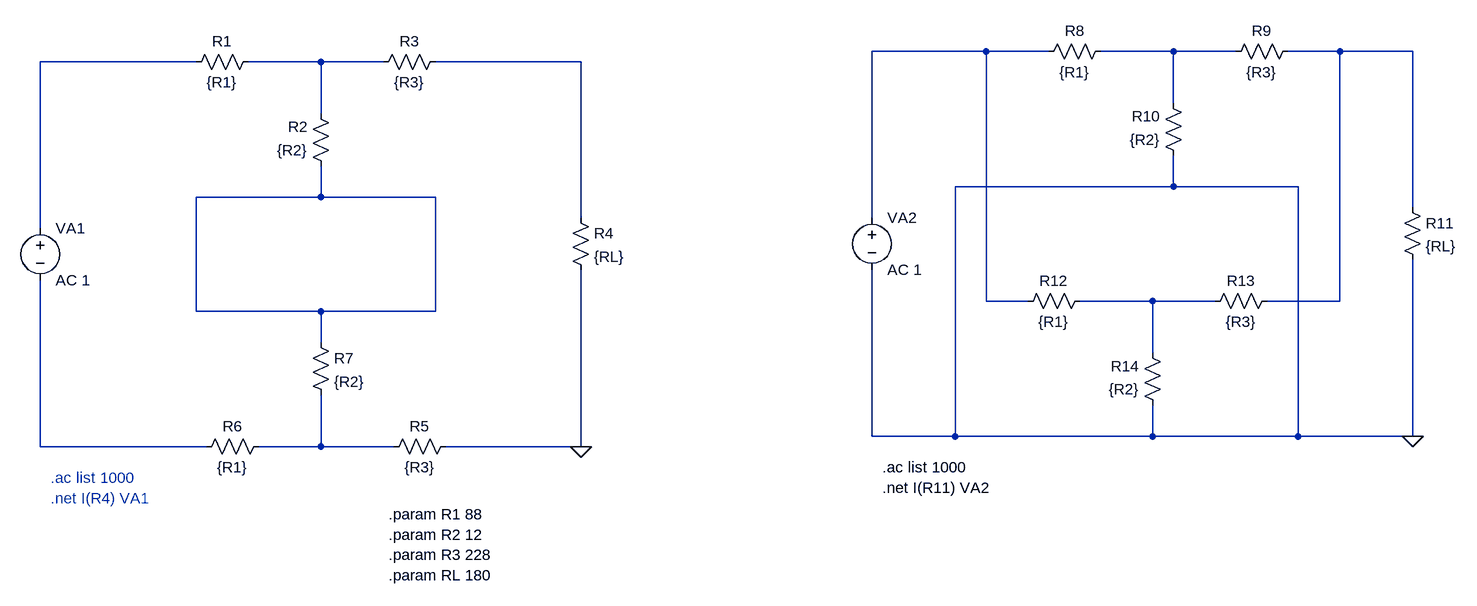
[diagram p0: schematic Draft1.asc]
Draft1.asc, the LTspice schematic file:
Version 4.1
SHEET 1 2536 1172
WIRE 1760 0 1584 0
WIRE 1856 0 1760 0
WIRE 2048 0 1936 0
WIRE 2144 0 2048 0
WIRE 2304 0 2224 0
WIRE 2416 0 2304 0
WIRE 544 16 304 16
WIRE 736 16 624 16
WIRE 832 16 736 16
WIRE 1136 16 912 16
WIRE 2048 80 2048 0
WIRE 736 96 736 16
WIRE 2048 208 2048 160
WIRE 2048 208 1712 208
WIRE 2240 208 2048 208
WIRE 736 224 736 176
WIRE 736 224 544 224
WIRE 912 224 736 224
WIRE 2416 240 2416 0
WIRE 1136 256 1136 16
WIRE 1584 256 1584 0
WIRE 304 272 304 16
WIRE 1760 384 1760 0
WIRE 1824 384 1760 384
WIRE 2016 384 1904 384
WIRE 2112 384 2016 384
WIRE 2304 384 2304 0
WIRE 2304 384 2192 384
WIRE 544 400 544 224
WIRE 736 400 544 400
WIRE 912 400 912 224
WIRE 912 400 736 400
WIRE 736 448 736 400
WIRE 2016 464 2016 384
WIRE 1584 592 1584 336
WIRE 1712 592 1712 208
WIRE 1712 592 1584 592
WIRE 2016 592 2016 544
WIRE 2016 592 1712 592
WIRE 2240 592 2240 208
WIRE 2240 592 2016 592
WIRE 2416 592 2416 320
WIRE 2416 592 2240 592
WIRE 304 608 304 352
WIRE 560 608 304 608
WIRE 736 608 736 528
WIRE 736 608 640 608
WIRE 848 608 736 608
WIRE 1136 608 1136 336
WIRE 1136 608 928 608
FLAG 1136 608 0
FLAG 2416 592 0
SYMBOL voltage 304 256 R0
SYMATTR InstName VA1
SYMATTR Value AC 1
SYMBOL res 640 0 R90
WINDOW 0 0 56 VBottom 2
WINDOW 3 32 56 VTop 2
SYMATTR InstName R1
SYMATTR Value {R1}
SYMBOL res 928 0 R90
WINDOW 0 0 56 VBottom 2
WINDOW 3 32 56 VTop 2
SYMATTR InstName R3
SYMATTR Value {R3}
SYMBOL res 752 192 R180
WINDOW 0 36 76 Left 2
WINDOW 3 36 40 Left 2
SYMATTR InstName R2
SYMATTR Value {R2}
SYMBOL res 1120 240 R0
SYMATTR InstName R4
SYMATTR Value {RL}
SYMBOL res 832 624 R270
WINDOW 0 32 56 VTop 2
WINDOW 3 0 56 VBottom 2
SYMATTR InstName R5
SYMATTR Value {R3}
SYMBOL res 544 624 R270
WINDOW 0 32 56 VTop 2
WINDOW 3 0 56 VBottom 2
SYMATTR InstName R6
SYMATTR Value {R1}
SYMBOL res 720 432 R0
SYMATTR InstName R7
SYMATTR Value {R2}
SYMBOL voltage 1584 240 R0
SYMATTR InstName VA2
SYMATTR Value AC 1
SYMBOL res 2400 224 R0
SYMATTR InstName R11
SYMATTR Value {RL}
SYMBOL res 1952 -16 R90
WINDOW 0 0 56 VBottom 2
WINDOW 3 32 56 VTop 2
SYMATTR InstName R8
SYMATTR Value {R1}
SYMBOL res 2240 -16 R90
WINDOW 0 0 56 VBottom 2
WINDOW 3 32 56 VTop 2
SYMATTR InstName R9
SYMATTR Value {R3}
SYMBOL res 2064 176 R180
WINDOW 0 36 76 Left 2
WINDOW 3 36 40 Left 2
SYMATTR InstName R10
SYMATTR Value {R2}
SYMBOL res 1920 368 R90
WINDOW 0 0 56 VBottom 2
WINDOW 3 32 56 VTop 2
SYMATTR InstName R12
SYMATTR Value {R1}
SYMBOL res 2208 368 R90
WINDOW 0 0 56 VBottom 2
WINDOW 3 32 56 VTop 2
SYMATTR InstName R13
SYMATTR Value {R3}
SYMBOL res 2032 560 R180
WINDOW 0 36 76 Left 2
WINDOW 3 36 40 Left 2
SYMATTR InstName R14
SYMATTR Value {R2}
TEXT 320 656 Left 2 ;.ac list 1000\n.net I(R4) VA1
TEXT 840 712 Left 2 !.param R1 88\n.param R2 12\n.param R3 228\n.param RL 180
TEXT 1600 640 Left 2 !.ac list 1000\n.net I(R11) VA2

The netlist it stands for:
* Draft1.asc
VA1 N004 N009 AC 1
R1 N005 N004 {R1}
R3 N006 N005 {R3}
R2 N007 N005 {R2}
R4 N006 0 {RL}
R5 N010 0 {R3}
R6 N009 N010 {R1}
R7 N007 N010 {R2}
VA2 N001 0 AC 1
R11 N003 0 {RL}
R8 N002 N001 {R1}
R9 N003 N002 {R3}
R10 0 N002 {R2}
R12 N008 N001 {R1}
R13 N003 N008 {R3}
R14 0 N008 {R2}
* .ac list 1000
* .net I(R4) VA1
.param R1 88
.param R2 12
.param R3 228
.param RL 180
.ac list 1000
.net I(R11) VA2
.backanno
.end